# EAGLE schematic Driver Board (EAGLE 6.0)
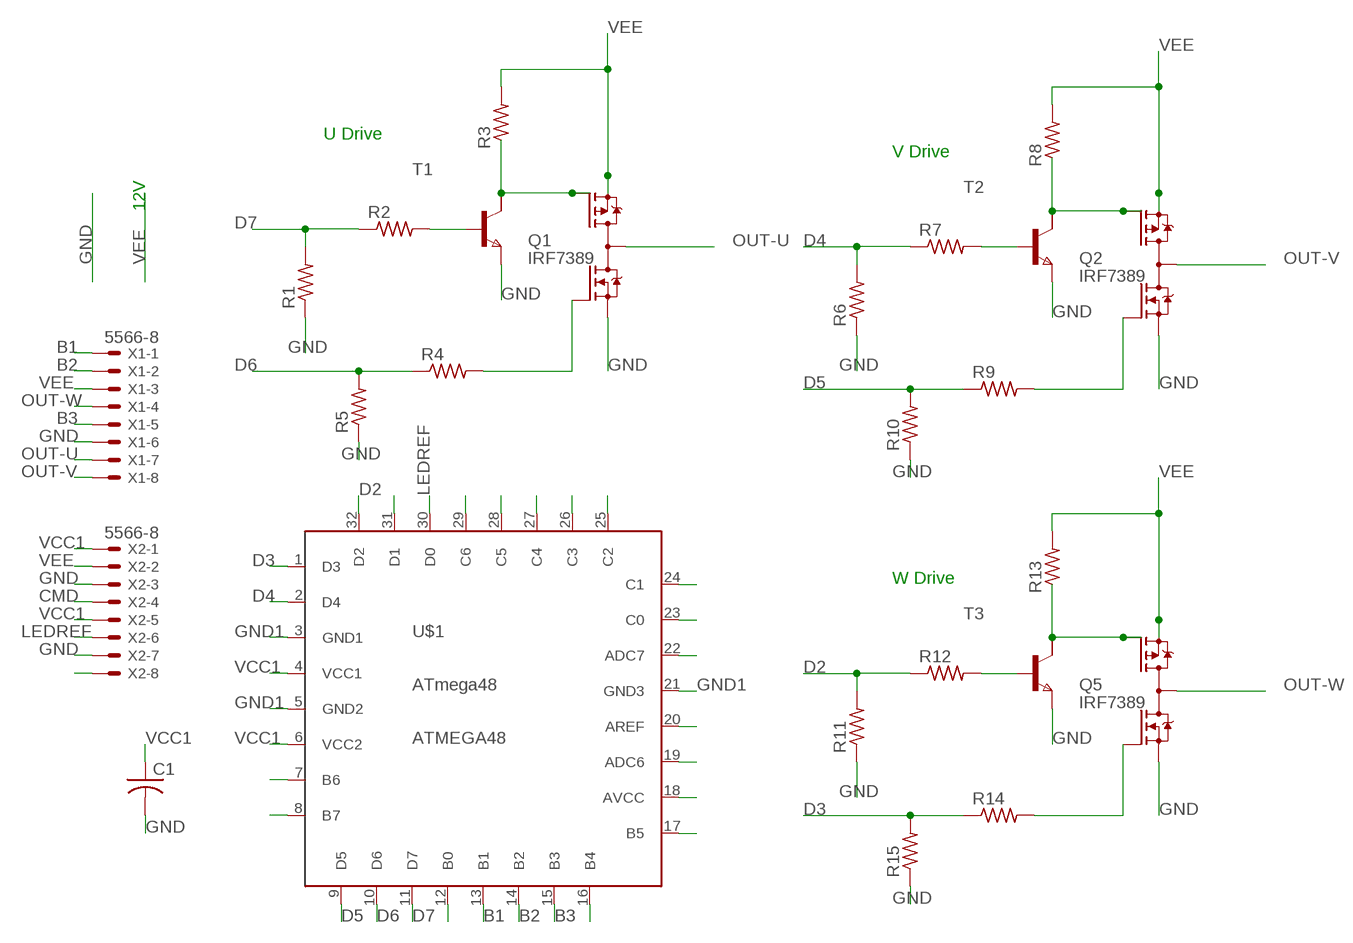
[diagram p0: schematic, sheet 1]

## Parts
C1  C-USC1206  [C1206]
Q1  IRF7389  [SO08-IRF]
Q2  IRF7389  [SO08-IRF]
Q5  IRF7389  [SO08-IRF]
R1  R-US_R1206  [R1206]
R2  R-US_R1206  [R1206]
R3  R-US_R1206  [R1206]
R4  R-US_R1206  [R1206]
R5  R-US_R1206  [R1206]
R6  R-US_R1206  [R1206]
R7  R-US_R1206  [R1206]
R8  R-US_R1206  [R1206]
R9  R-US_R1206  [R1206]
R10  R-US_R1206  [R1206]
R11  R-US_R1206  [R1206]
R12  R-US_R1206  [R1206]
R13  R-US_R1206  [R1206]
R14  R-US_R1206  [R1206]
R15  R-US_R1206  [R1206]
T1  NPNSOT223  [SOT223]
T2  NPNSOT223  [SOT223]
T3  NPNSOT223  [SOT223]
U$1  ATMEGA48  [ATMEGA48]
X1  5566-8  [5566-8]
X2  5566-8  [5566-8]

## Nets
B1: U$1.13(B1) X1.1
B2: U$1.14(B2) X1.2
B3: U$1.15(B3) X1.5
CMD: X2.4
D2: R11.2 R12.1 U$1.32(D2)
D3: R14.1 R15.2 U$1.1(D3)
D4: R6.2 R7.1 U$1.2(D4)
D5: R9.1 R10.2 U$1.9(D5)
D6: R4.1 R5.2 U$1.10(D6)
D7: R1.2 R2.1 U$1.11(D7)
GND: C1.2 Q1.1(N-S) Q2.1(N-S) Q5.1(N-S) R1.1 R5.1 R6.1 R10.1 R11.1 R15.1 T1.3(E) T2.3(E) T3.3(E) X1.6 X2.3 X2.7
GND1: U$1.3(GND1) U$1.5(GND2) U$1.21(GND3)
LEDREF: U$1.30(D0) X2.6
N$1: Q1.4(P-G) T1.2(C1)
N$2: Q2.4(P-G) T2.2(C1)
N$4: X2.8
N$5: R2.2 T1.1(B)
N$6: R7.2 T2.1(B)
N$8: Q1.2(N-G) R4.2
N$10: Q2.2(N-G) R9.2
N$11: Q5.4(P-G) T3.2(C1)
N$13: R12.2 T3.1(B)
N$15: Q5.2(N-G) R14.2
N$16: U$1.7(B6)
N$17: U$1.8(B7)
N$19: U$1.31(D1)
N$21: U$1.29(C6)
N$22: U$1.28(C5)
N$23: U$1.27(C4)
N$24: U$1.26(C3)
N$25: U$1.25(C2)
N$26: U$1.24(C1)
N$27: U$1.23(C0)
N$28: U$1.22(ADC7)
N$30: U$1.20(AREF)
N$31: U$1.19(ADC6)
N$32: U$1.18(AVCC)
N$33: U$1.17(B5)
N$37: U$1.12(B0)
N$41: U$1.16(B4)
OUT-U: Q1.5(D) Q1.6(D) Q1.7(D) Q1.8(D) X1.7
OUT-V: Q2.5(D) Q2.6(D) Q2.7(D) Q2.8(D) X1.8
OUT-W: Q5.5(D) Q5.6(D) Q5.7(D) Q5.8(D) X1.4
VCC1: C1.1 U$1.4(VCC1) U$1.6(VCC2) X2.1 X2.5
VEE: Q1.3(P-S) Q2.3(P-S) Q5.3(P-S) R3.2 R8.2 R13.2 X1.3 X2.2
Unconnected: R3.1 R8.1 R13.1 T1.4(C2) T2.4(C2) T3.4(C2)

## Notes on the sheet
- U Drive
- V Drive
- 12V
- W Drive

## Library data of the parts
C1 = resistor:C-US: CAPACITOR, American symbol
Q1 Q2 Q5 = transistor-fet:IRF7389: Complimentary Half Bridge HEXFET Power MOSFET Source: http://www.irf.com/product-info/datasheets/data/irf7389.pdf
R1-R15 = rcl:R-US_: RESISTOR, American symbol
T1-T3 = zetex:NPNSOT223: NPN TRANSISTOR; MPN: DJT4031N-13; OC_FARNELL: 1710672; OC_NEWARK: 25R4490
U$1 = ATmega48:ATMEGA48
X1 X2 = con-molex:5566-8: Mini FIT connector 8 pol Source: http://www.molex.com; OC_FARNELL: unknown; OC_NEWARK: unknown